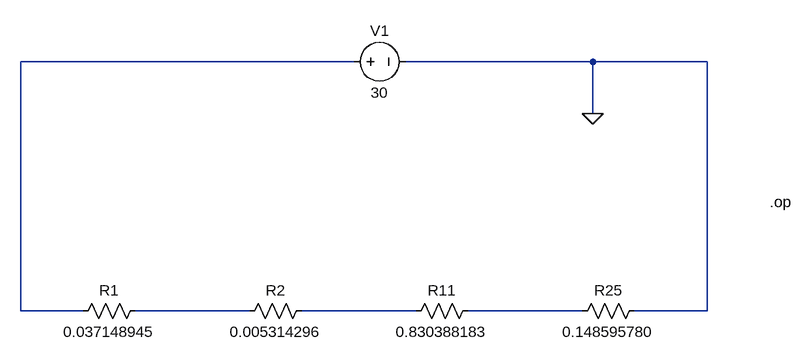
[diagram p0: schematic window_thermal_model_bare.asc]
window_thermal_model_bare.asc, the LTspice schematic file:
Version 4
SHEET 1 1964 856
WIRE 480 -96 -32 -96
WIRE 848 -96 560 -96
WIRE 1024 -96 848 -96
WIRE 848 -16 848 -96
WIRE -32 288 -32 -96
WIRE 64 288 -32 288
WIRE 320 288 144 288
WIRE 576 288 400 288
WIRE 832 288 656 288
WIRE 1024 288 1024 -96
WIRE 1024 288 912 288
FLAG 848 -16 0
SYMBOL res 48 304 R270
WINDOW 0 32 56 VTop 2
WINDOW 3 0 56 VBottom 2
SYMATTR InstName R1
SYMATTR Value 0.037148945
SYMBOL res 560 304 R270
WINDOW 0 32 56 VTop 2
WINDOW 3 0 56 VBottom 2
SYMATTR InstName R11
SYMATTR Value 0.830388183
SYMBOL res 816 304 R270
WINDOW 0 32 56 VTop 2
WINDOW 3 0 56 VBottom 2
SYMATTR InstName R25
SYMATTR Value 0.148595780
SYMBOL voltage 464 -96 R270
WINDOW 0 32 56 VTop 2
WINDOW 3 -32 56 VBottom 2
SYMATTR InstName V1
SYMATTR Value 30
SYMATTR SpiceLine Rser=0
SYMBOL res 304 304 R270
WINDOW 0 32 56 VTop 2
WINDOW 3 0 56 VBottom 2
SYMATTR InstName R2
SYMATTR Value 0.005314296
TEXT 1120 120 Left 2 !.op

The netlist it stands for:
* window_thermal_model_bare.asc
R1 N001 N002 0.037148945
R11 N003 N004 0.830388183
R25 N004 0 0.148595780
V1 N001 0 30 Rser=0
R2 N002 N003 0.005314296
.op
.backanno
.end